# EAGLE design BATT MONITOR (EAGLE 9.6.2)

## Sheet 1 of 2

## Sheet 2 of 2
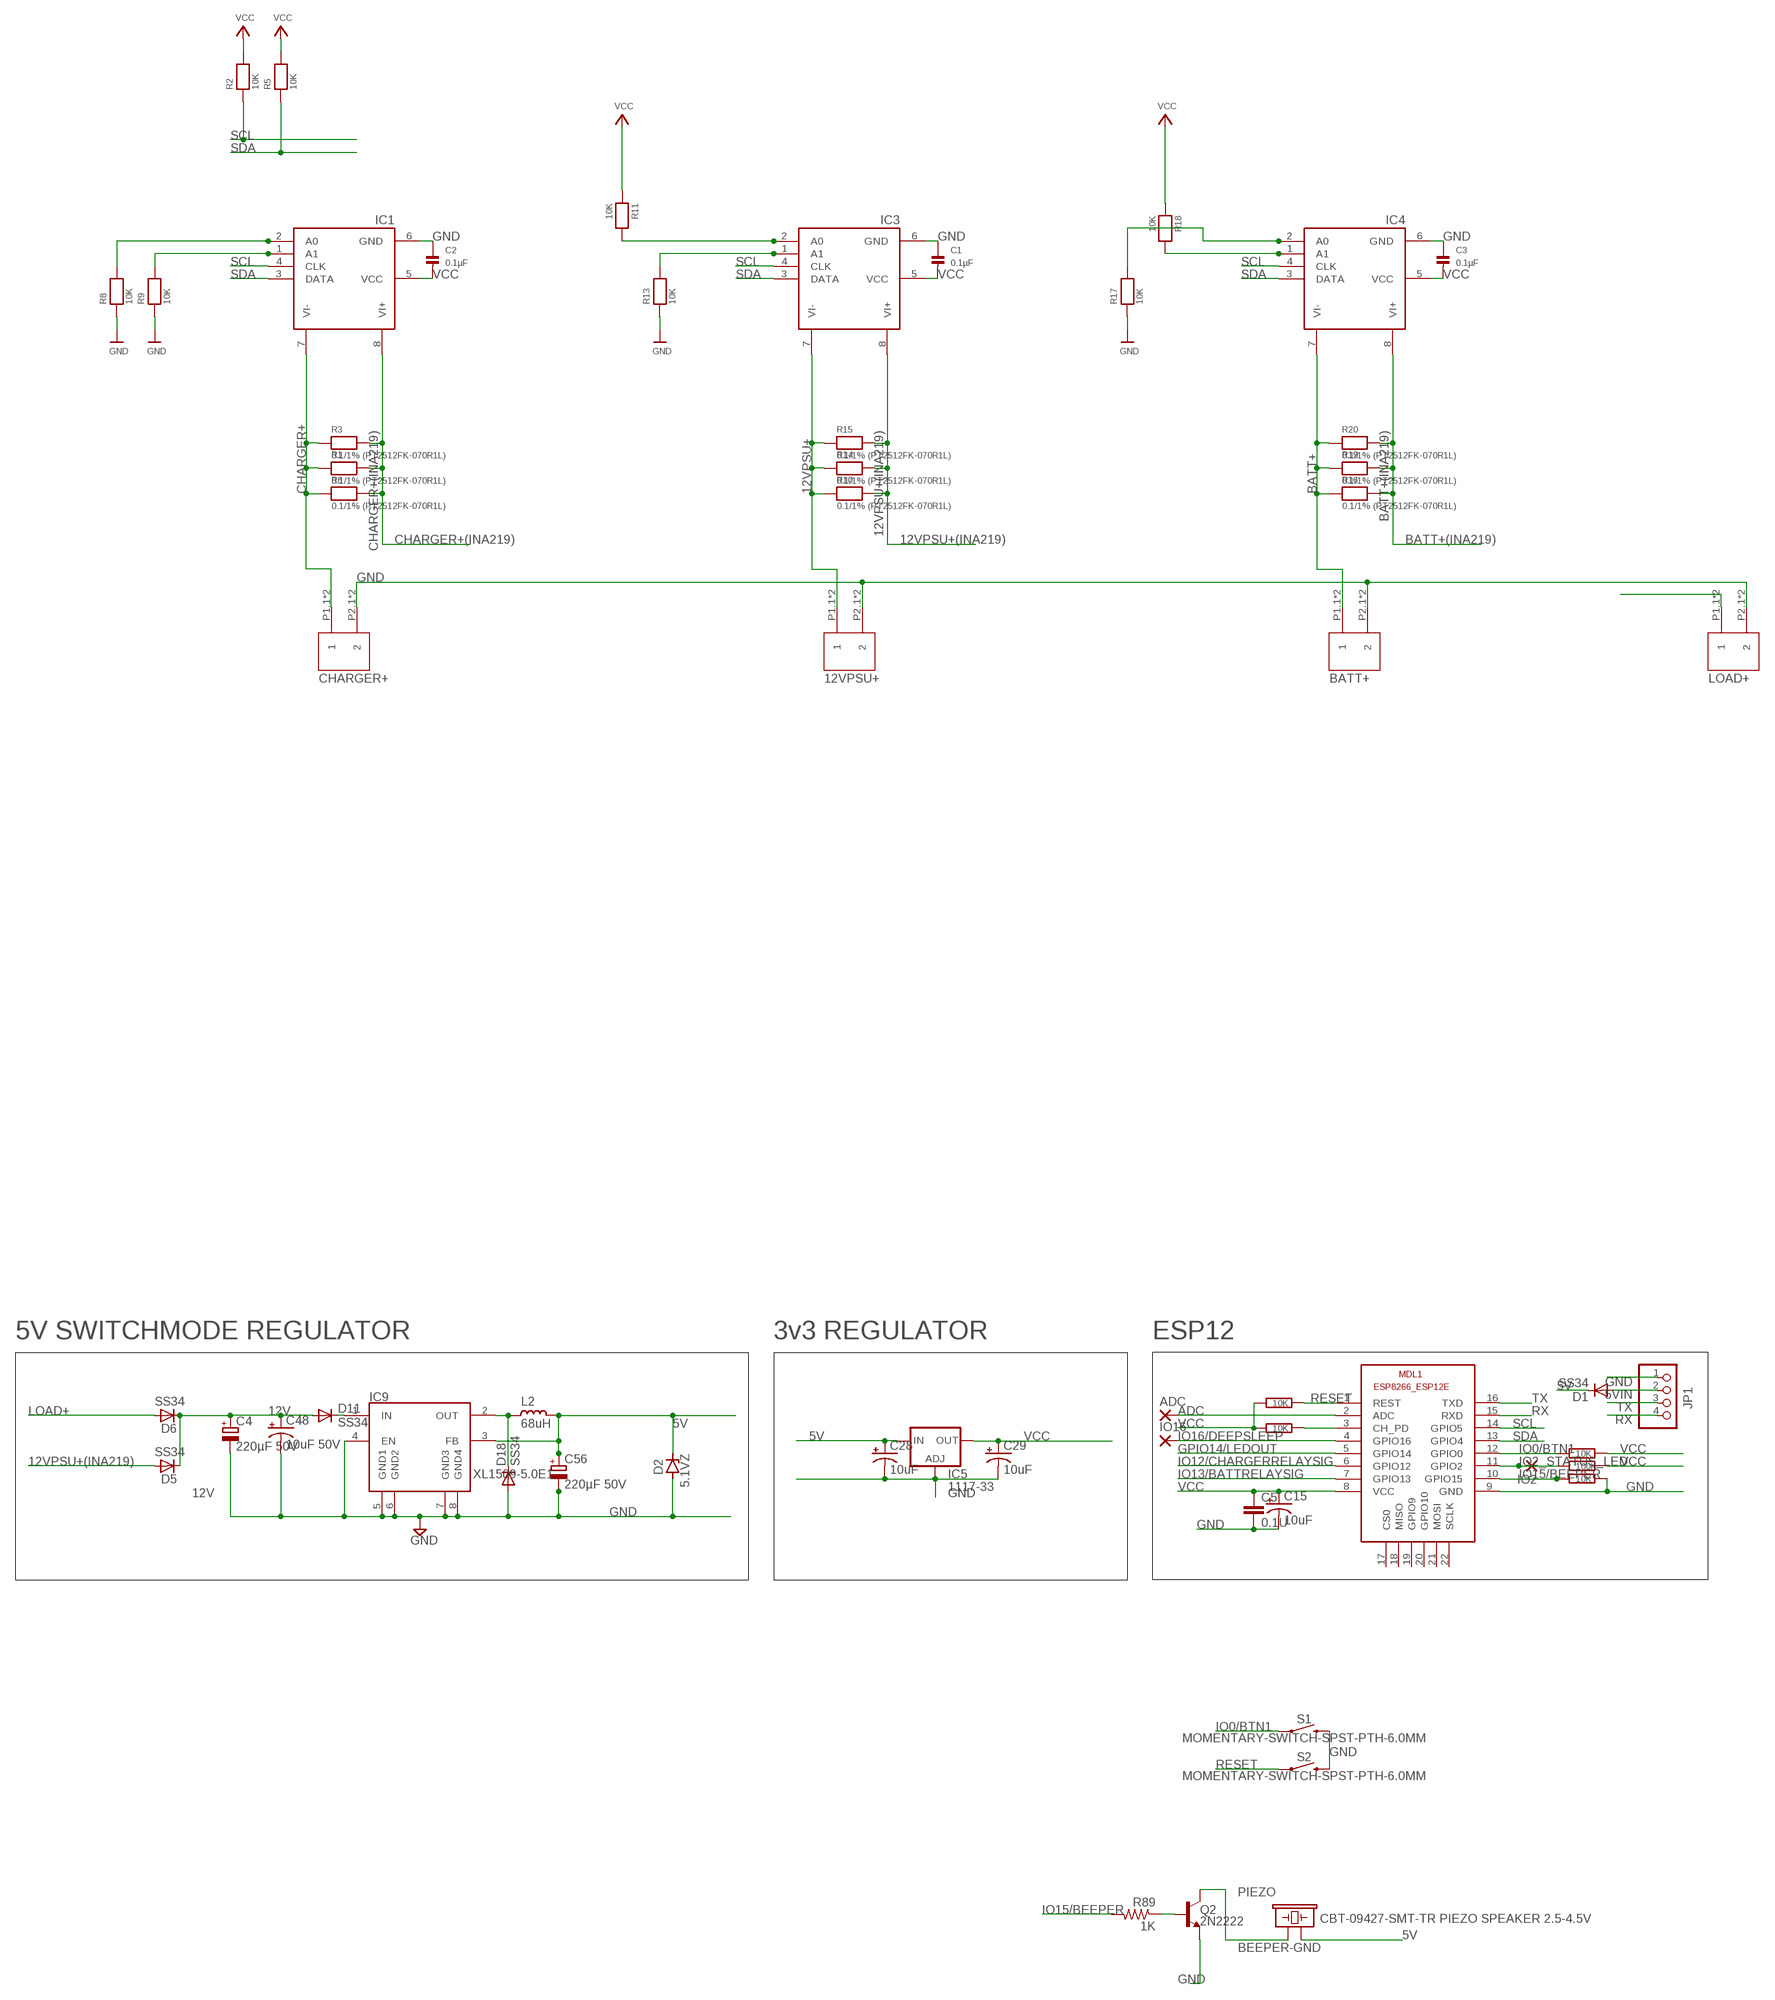
[diagram p0: schematic, sheet 2, part 1 of 2]
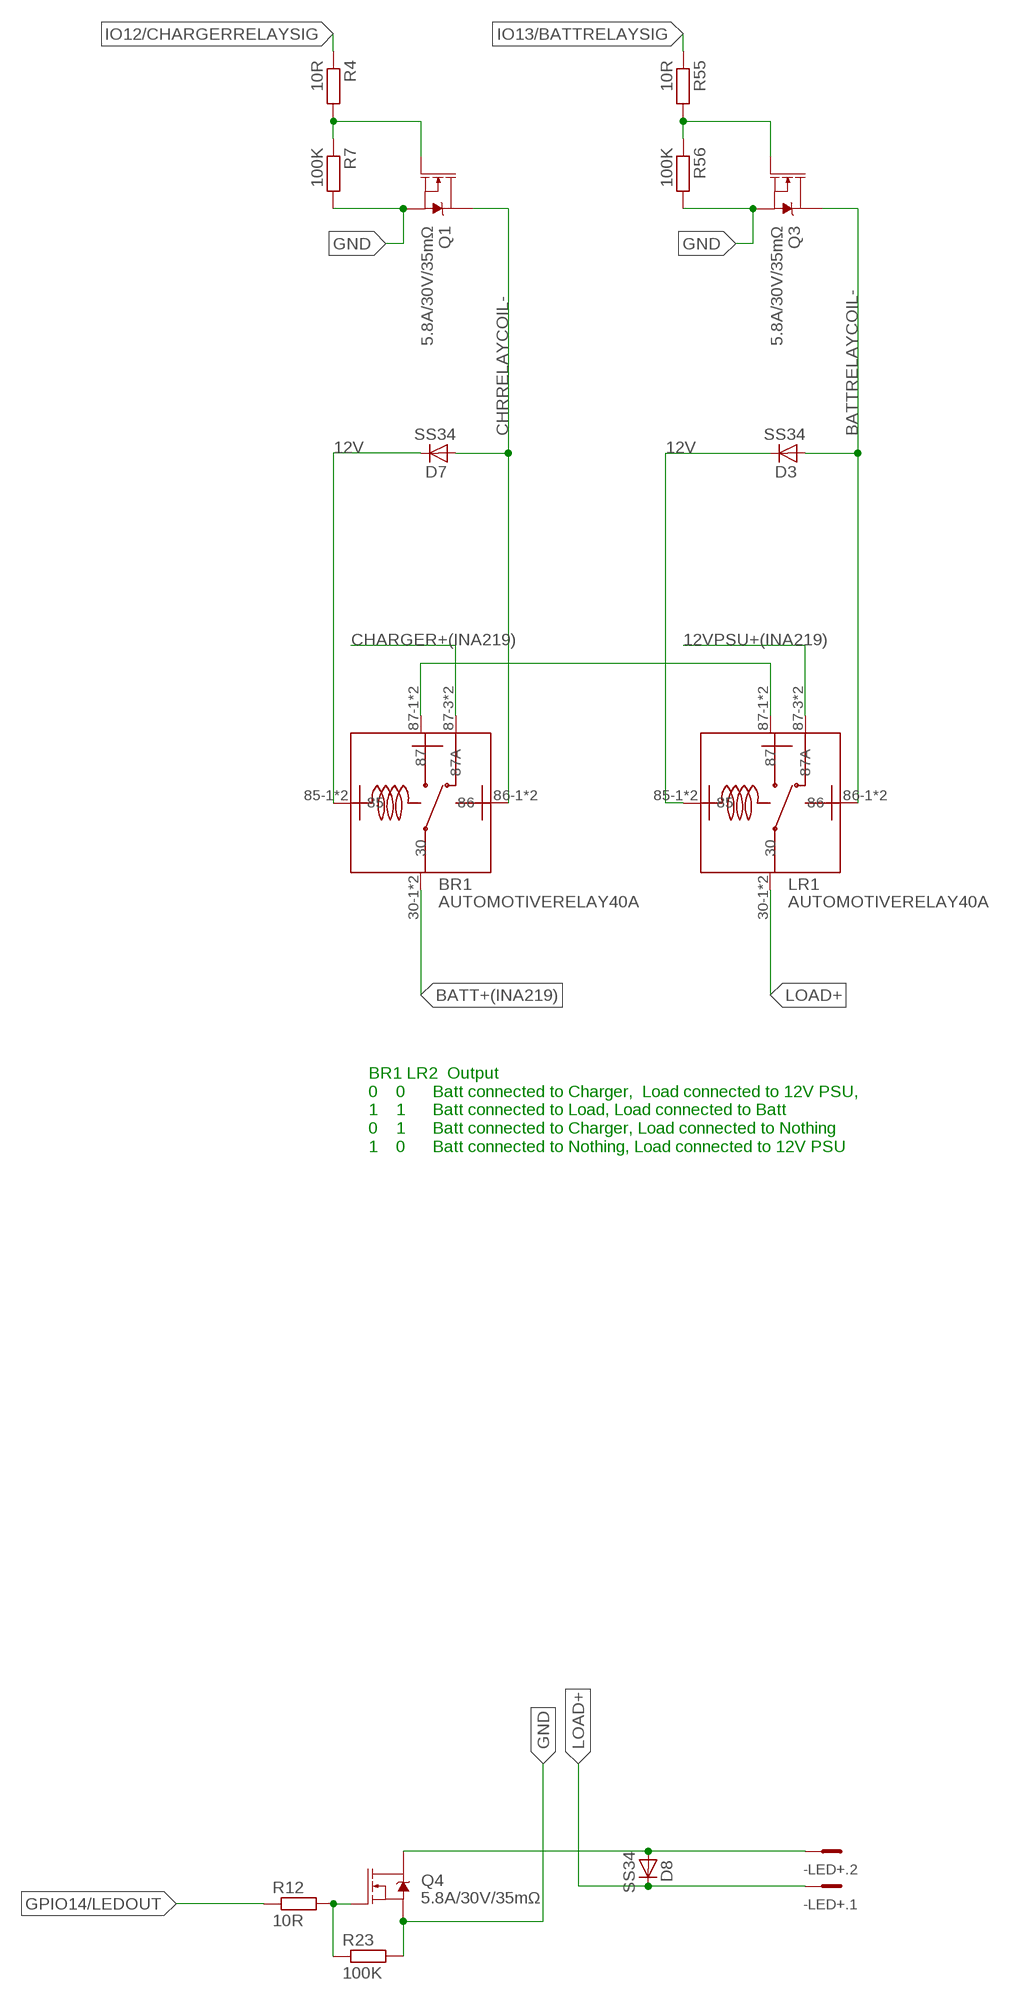
[diagram p1: schematic, sheet 2, part 2 of 2]

### Parts
-LED+  MCV2  [MCV2]
ADC  2,54/1,1  [2,54/1,1]
BR1  AUTOMOTIVERELAY40A  [AUTOMOTIVERELAY40A]
C1  0.1µF  CAP_CERAMIC1206  [1206]
C2  0.1µF  CAP_CERAMIC1206  [1206]
C3  0.1µF  CAP_CERAMIC1206  [1206]
C4  220µF 50V  CPOL-EUE3.5-10  [E3,5-10]
C5  0.1U  C-EUC1206  [C1206]
C15  10uF  CAP_POL1206  [EIA3216]
C28  10uF  CAP_POL1206  [EIA3216]
C29  10uF  CAP_POL1206  [EIA3216]
C48  10uF 50V  CAP_POL1206  [EIA3216]
C56  220µF 50V  CPOL-EUE3.5-10  [E3,5-10]
CHARGER1  BARRIERTERMINAL  [BARRIERTERMINAL]
CHARGER2  BARRIERTERMINAL  [BARRIERTERMINAL]
CHARGER3  BARRIERTERMINAL  [BARRIERTERMINAL]
CHARGER4  BARRIERTERMINAL  [BARRIERTERMINAL]
D1  SS34  DIODE-DO-214AC  [DO-214AC]
D2  5.1VZ  ZENER-DIODESMB  [SMB]
D3  SS34  D-SOD-87  [SOD87]
D5  SS34  D-SOD-87  [SOD87]
D6  SS34  D-SOD-87  [SOD87]
D7  SS34  D-SOD-87  [SOD87]
D8  SS34  D-SOD-87  [SOD87]
D11  SS34  DIODE-DO-214AC  [DO-214AC]
D18  SS34  DIODE-DO-214AC  [DO-214AC]
IC1  INA219D  [SO08]
IC3  INA219D  [SO08]
IC4  INA219D  [SO08]
IC5  1117-33  LD117AS33TR  [SOT223]
IC9  XL1509-5.0E1  XL1509  [SO08]
IO2  2,54/1,1  [2,54/1,1]
IO16  2,54/1,1  [2,54/1,1]
JP1  PINHD-1X4  [1X04]
L2  68uH  L_CD75  [CD75]
LR1  AUTOMOTIVERELAY40A  [AUTOMOTIVERELAY40A]
MDL1  ESP8266-12EESP8266-ESP12E  [ESP8266-ESP12E]
PIEZO  CBT-09427-SMT-TR PIEZO SPEAKER 2.5-4.5V  BUZZER-PTH  [BUZZER-12MM]
Q1  5.8A/30V/35mΩ  MOSFET-NCH-AO3404A  [SOT23-3]
Q2  2N2222  TRANS_NPN-MMBT2222AL  [SOT23-3]
Q3  5.8A/30V/35mΩ  MOSFET-NCH-AO3404A  [SOT23-3]
Q4  5.8A/30V/35mΩ  MOSFET-NCH-AO3404A  [SOT23-3]
R1  0.1/1% (PT2512FK-070R1L)  RESISTOR2512  [2512]
R2  10K  RESISTOR1206  [1206]
R3  0.1/1% (PT2512FK-070R1L)  RESISTOR2512  [2512]
R4  10R  R-EU_R1206  [R1206]
R5  10K  RESISTOR1206  [1206]
R6  0.1/1% (PT2512FK-070R1L)  RESISTOR2512  [2512]
R7  100K  R-EU_R1206  [R1206]
R8  10K  RESISTOR1206  [1206]
R9  10K  RESISTOR1206  [1206]
R10  0.1/1% (PT2512FK-070R1L)  RESISTOR2512  [2512]
R11  10K  RESISTOR1206  [1206]
R12  10R  R-EU_M1206  [M1206]
R13  10K  RESISTOR1206  [1206]
R14  0.1/1% (PT2512FK-070R1L)  RESISTOR2512  [2512]
R15  0.1/1% (PT2512FK-070R1L)  RESISTOR2512  [2512]
R16  0.1/1% (PT2512FK-070R1L)  RESISTOR2512  [2512]
R17  10K  RESISTOR1206  [1206]
R18  10K  RESISTOR1206  [1206]
R19  0.1/1% (PT2512FK-070R1L)  RESISTOR2512  [2512]
R20  0.1/1% (PT2512FK-070R1L)  RESISTOR2512  [2512]
R21  100K  R-EU_R1206  [R1206]
R22  10K  R-EU_R1206  [R1206]
R23  100K  R-EU_M1206  [M1206]
R28  10K  R-EU_R1206  [R1206]
R29  10K  R-EU_R1206  [R1206]
R31  10K  R-EU_R1206  [R1206]
R55  10R  R-EU_R1206  [R1206]
R56  100K  R-EU_R1206  [R1206]
R89  1K  R-US_R1206  [R1206]
S1  MOMENTARY-SWITCH-SPST-PTH-6.0MM  [TACTILE_SWITCH_PTH_6.0MM]
S2  MOMENTARY-SWITCH-SPST-PTH-6.0MM  [TACTILE_SWITCH_PTH_6.0MM]

### Nets
5V: C28.A(+) C56.+ D1.1(C) D2.C IC5.3(IN) IC9.3(FB) L2.1 PIEZO.+
5VIN: D1.2(A) JP1.2
12V: BR1.85-1 BR1.85-2 C4.+ C48.A(+) D3.1(C) D5.1(C) D6.1(C) D7.1(C) D11.2(A) LR1.85-1 LR1.85-2
12VPSU+: CHARGER4.P1.1 CHARGER4.P1.2 IC3.7(VI-) R10.1 R14.1 R15.1
12VPSU+(INA219): D5.2(A) IC3.8(VI+) LR1.87-3(87A) LR1.87-4(87A) R10.2 R14.2 R15.2
ADC: ADC.1(P) MDL1.2(ADC)
BATT+: CHARGER1.P1.1 CHARGER1.P1.2 IC4.7(VI-) R16.1 R19.1 R20.1
BATT+(INA219): BR1.30-1 BR1.30-2 IC4.8(VI+) R16.2 R19.2 R20.2
BATTRELAYCOIL-: D3.2(A) LR1.86-1 LR1.86-2 Q3.3(D)
BEEPER-GND: PIEZO.- Q2.3(C)
CHARGER+: CHARGER3.P1.1 CHARGER3.P1.2 IC1.7(VI-) R1.1 R3.1 R6.1
CHARGER+(INA219): BR1.87-3(87A) BR1.87-4(87A) IC1.8(VI+) R1.2 R3.2 R6.2
CHRRELAYCOIL-: BR1.86-1 BR1.86-2 D7.2(A) Q1.3(D)
GND: C1.1 C2.1 C3.1 C4.- C5.2 C15.C(-) C28.C(-) C29.C(-) C48.C(-) C56.- CHARGER1.P2.1 CHARGER1.P2.2 CHARGER2.P2.1 CHARGER2.P2.2 CHARGER3.P2.1 CHARGER3.P2.2 CHARGER4.P2.1 CHARGER4.P2.2 D2.A D18.2(A) IC1.6(GND) IC3.6(GND) IC4.6(GND) IC5.1(ADJ) IC9.4(EN) IC9.5(GND1) IC9.6(GND2) IC9.7(GND3) IC9.8(GND4) JP1.1 MDL1.9(GND) Q1.2(S) Q2.2(E) Q3.2(S) Q4.2(S) R7.2 R8.1 R9.1 R13.1 R17.1 R23.2 R31.2 R56.2 S1.3 S2.3
GPIO14/LEDOUT: MDL1.5(GPIO14) R12.1
IO0/BTN1: MDL1.12(GPIO0) R22.1 S1.1
IO2_STATUS_LED: IO2.1(P) MDL1.11(GPIO2) R21.1
IO12/CHARGERRELAYSIG: MDL1.6(GPIO12) R4.1
IO13/BATTRELAYSIG: MDL1.7(GPIO13) R55.1
IO15/BEEPER: MDL1.10(GPIO15) R31.1 R89.2
IO16/DEEPSLEEP: IO16.1(P) MDL1.4(GPIO16)
LOAD+: -LED+.1 CHARGER2.P1.1 CHARGER2.P1.2 D6.2(A) D8.1(C) LR1.30-1 LR1.30-2
N$1: D18.1(C) IC9.2(OUT) L2.2
N$2: Q4.1(G) R12.2 R23.1
N$4: IC1.1(A1) R9.2
N$7: IC1.2(A0) R8.2
N$8: Q1.1(G) R4.2 R7.1
N$9: BR1.87-1 BR1.87-2 LR1.87-1 LR1.87-2
N$11: Q2.1(B) R89.1
N$13: IC3.1(A1) R13.2
N$14: IC3.2(A0) R11.2
N$15: IC4.1(A1) R18.2
N$16: IC4.2(A0) R17.2
N$18: MDL1.3(CH_PD) R28.2
N$26: D11.1(C) IC9.1(IN)
N$37: Q3.1(G) R55.2 R56.1
N$41: -LED+.2 D8.2(A) Q4.3(D)
RESET: MDL1.1(REST) R29.2 S2.1
RX: JP1.4 MDL1.15(RXD)
SCL: IC1.4(CLK) IC3.4(CLK) IC4.4(CLK) MDL1.14(GPIO5) R2.1
SDA: IC1.3(DATA) IC3.3(DATA) IC4.3(DATA) MDL1.13(GPIO4) R5.1
TX: JP1.3 MDL1.16(TXD)
VCC: C1.2 C2.2 C3.2 C5.1 C15.A(+) C29.A(+) IC1.5(VCC) IC3.5(VCC) IC4.5(VCC) IC5.4(OUT) MDL1.8(VCC) R2.2 R5.2 R11.1 R18.1 R21.2 R22.2 R28.1 R29.1
Unconnected: MDL1.17(CS0) MDL1.18(MISO) MDL1.19(GPIO9) MDL1.20(GPIO10) MDL1.21(MOSI) MDL1.22(SCLK)

### Notes on the sheet
- BR1 LR2  Output
  0    0      Batt connected to Charger,  Load connected to 12V PSU,
  1    1      Batt connected to Load, Load connected to Batt
  0    1      Batt connected to Charger, Load connected to Nothing
  1    0      Batt connected to Nothing, Load connected to 12V PSU
- 5V SWITCHMODE REGULATOR | 3v3 REGULATOR | ESP12

## Library data of the parts
-LED+ = con-phoenix-381_l:MCV2: Mini-Combicon 3.81mm vertikal 2polig MCV 1,5/2-G-3,81 Artikel-Nr. 1803426
ADC IO2 IO16 = wirepad:2,54/1,1: THROUGH-HOLE PAD
BR1 LR1 = AUTOMOTIVERELAYS:AUTOMOTIVERELAY40A
C1-C3 = microbuilder:CAP_CERAMIC: Ceramic Capacitors 0402 - 0402 Surface Mount Capacitors 16pF 50V 5% [Digikey: 445-4899-2-ND] 18pF 50V 5% [Digikey: 490-1281-2-ND] 22pF 50V 5% [Digikey: 490-1283-2-ND] 68pF 50V 5% [Digikey: 490-1289-2-ND] 0.1uF 10V 10% [Digikey: 490-1318-2-ND] 1.0uF 6.3V 10% [Digikey: 490-1320-2-ND] 0603 - 0603 Surface Mount Capacitors 16 pF 50V 5% [Digikey: 445-5051-2-ND] 22 pF 50V [Digikey: PCC220ACVTR-ND] 33 pF 50V 5% [Digikey: 490-1415-1-ND] 56pF 50V 5% [Digikey: 490-1421-1-ND] 220pF 50V 5% [Digikey: 445-1285-1-ND] 680 pF 50V 2200 pF 50V 5% C0G [Digikey: 445-1297-1-ND] 5600 pF 100V 5% X7R [Digikey: 478-3711-1-ND] 0.1 µF 25V 10% [Digikey: PCC2277TR-ND] 0.22 µF 16V 10% X7R [Digikey: 445-1318-1-ND] 1.0 µF 25V 10% [Digikey: 445-5146-2-ND] 0603 - RF Specific 3pF 250V +/-0.1pF RF [Digikey: 712-1347-1-ND] 18 pF 250V 5% [Digikey: 478-3505-1-ND or 712-1322-1-ND] 56 pF 250V 5% C0G RF [Digikey: 490-4867-1-ND] 68 pF 250V RF [Digikey: 490-4868-1-ND] 0805 - 0805 Surface Mount Capacitors 220 pF 250V 2% RF Ceramic Capacitor [Digikey: 712-1398-1-ND] 1000 pF 50V 2% NP0 Ceramic Capacitor [Digikey: 478-3760-1-ND] 0.1 µF 25V 10% Ceramic Capacitor [Digikey: PCC1828TR-ND] 1.0 µF 16V 10% Ceramic Capacitor[Digikey: 490-1691-2-ND] 10.0 µF 10V 10% Ceramic Capacitor[Digikey: 709-1228-1-ND] 10.0 uF 16V 10% Ceramic Capacitor [Digikey: 478-5165-2-ND] 47 uF 6.3V 20% Ceramic Capacitor [Digikey: 587-1779-1-ND or 399-5506-1-ND] 1206 - 1206 Surface Mount Capacitors 47uF 10V 20% Ceramic Capacitor [Digikey: 490-5528-1-ND or 399-5508-1-ND or 445-6010-1-ND] 100uF 6.3V -20%, +80% Y5V Ceramic Capacitor (Digikey: 490-4512-1-ND, Mouser: 81-GRM31CF50J107ZE1L)
C4 C56 = rcl:CPOL-EU: POLARIZED CAPACITOR, European symbol; SPICEPREFIX: C
C5 = rcl:C-EU: CAPACITOR, European symbol
C15 C28 C29 C48 = SparkFun:CAP_POL: Capacitor Polarized These are standard SMD and PTH capacitors. Normally 10uF, 47uF, and 100uF in electrolytic and tantalum varieties. Always verify the external diameter of the through hole cap, it varies with capacity, voltage, and manufacturer. The EIA devices should be standard.
CHARGER1-CHARGER4 = Barrier Terminals 2 pin:BARRIERTERMINAL
D1 D11 D18 = dp_devices:DIODE: Various Diode Packages
D2 = diode:ZENER-DIODE: Z-Diode
D3 D5-D8 = semicon-smd-ipc:D-: DIODE unfilled
IC1 IC3 IC4 = AWJLEagleLib:INA219: Texas Instruments INA219 power monitor
IC5 = v-reg:LD117A?*: Low drop fixed and adjustable positive voltage regulators 1 A Source: http://www.st.com/stonline/products/literature/ds/7194/ld1117axx.pdf
IC9 = Cohesion_parts:XL1509
JP1 = pinhead:PINHD-1X4: PIN HEADER
L2 = rc-master-smd:L_: INDUCTOR
MDL1 = ESP8266-ESP12E:ESP8266-12E: ESP8266-12E with additional I/O and GPIO04/05 corrected The author cannot warrant that this library is free from error or will meet your specific requirements. Created by PuceBaboon.com. Komagane, Nagano, JAPAN
PIEZO = SparkFun-Electromechanical:BUZZER: Buzzer Small round buzzers that operate around the audible 2kHz range. You can use these as speakers to create simple music or user interfaces. Variant Overview: PTH - Mini Speaker - PC Mount 12mm 2.048kHz <https://www.sparkfun.com/products/7950> PTH_KIT - Mini Speaker - PC Mount 12mm 2.048kHz <https://www.sparkfun.com/products/7950> KIT simplifies soldering by adding stop mask to one side of the pads. PTH_NO_SILK - Mini Speaker - PC Mount 12mm 2.048kHz <https://www.sparkfun.com/products/7950> No silkscreen indicator of buzzer outline. PTH_KIT_NO_SILK - Mini Speaker - PC Mount 12mm 2.048kHz <https://www.sparkfun.com/products/7950> KIT package w/o silkscreen SMD - Buzzer Audio Magnetic (CCV-084B16) SMD buzzer used on, e.g. the LilyPad Buzzer <https://www.sparkfun.com/products/8463> and RFID USB Reader <https://www.sparkfun.com/products/9963>. SMD_KIT - Buzzer Audio Magnetic (CCV-084B16) SMD Buzzer with elongated pins to make soldering easier. Used on the SparkFun Simon Says - Surface Mount Soldering Kit <https://www.sparkfun.com/products/10935>.; PROD_ID: COMP-08253; SF_SKU: COM-07950
Q1 Q3 Q4 = SparkFun-DiscreteSemi:MOSFET-NCH: N-channel MOSFETs Voltage controlled devices that allow control of high current outputs. SparkFun Products: SparkFun OpenScale <https://www.sparkfun.com/products/13261> SparkFun Digital Sandbox <https://www.sparkfun.com/products/12651> SparkFun Monster Moto Shield <https://www.sparkfun.com/products/10182> SparkFun MOSFET Power Controller <https://www.sparkfun.com/products/11214>; PROD_ID: TRANS-12988
Q2 = SparkFun-DiscreteSemi:TRANS_NPN: NPN transistor Current controlled devices typically used to amplify current or used as a switch. BC547 - COM-08928 <http://www.sparkfun.com/products/8928> (TO-92 45V 100mA) (1.Collector 2.Base 3.Emitter) 2N3904 - COM-00521 <http://www.sparkfun.com/products/521> (TO-92 40V 200mA) (1.Emitter 2.Base 3.Collector) P2N2222A - COM-12852 <http://www.sparkfun.com/products/12852> (TO-92 40V 600mA) (1.Collector 2.Base 3.Emitter); PROD_ID: TRANS-08049; VALUE: 600mA/40V
R1-R3 R5 R6 R8-R11 R13-R20 = microbuilder:RESISTOR: Resistors 0402 - 0402 Surface Mount Package 22 Ohm 1% 1/16W [Digikey: 311-22.0LRTR-ND] 33 Ohm 5% 1/16W 1.0K 5% 1/16W 1.5K 5% 1/16W 2.0K 1% 1/16W 10.0K 1% 1/16W [Digikey: 311-10.0KLRTR-ND] 10.0K 5% 1/16W [Digikey: RMCF0402JT10K0TR-ND] 12.1K 1% 1/16W [Digikey: 311-22.0LRTR-ND] 100.0K 5% 1/16W 0603 - 0603 Surface Mount Package 0 Ohm 1/10 Watt 1% Resistor 15 Ohm 1/10 Watt 1% Resistor 33 Ohm 1/10 Watt 1% Resistor 49.9 Ohm 1/10 Watt 1% Resistor 100 Ohm 1/10 Watt 1% Resistor 150 Ohm 1/10 Watt 1% Resistor 240 Ohm 1/10 Watt 1% Resistor 390 Ohm 1/10 Watt 1% Resistor 560 Ohm 1/10 Watt 1% Resistor 680 Ohm 1/10 Watt 1% Resistor 750 Ohm 1/10 Watt 1% Resistor 1.0K Ohm 1/10 Watt 1% Resistor 1.5K Ohm 1/10 Watt 1% Resistor 2.0K Ohm 1/10 Watt 1% Resistor 2.2K Ohm 1/10 Watt 1% Resistor 3.3K Ohm 1/10 Watt 1% Resistor 4.7K Ohm 1/10 Watt 1% Resistor 10.0K Ohm 1/10 Watt 1% Resistor 12.0K Ohm 1/10 Watt 1% Resistor 12.1K Ohm 1/10 Watt 1% Resistor 20.0K Ohm 1/10 Watt 1% Resistor 33.0K Ohm 1/10 Watt 1% Resistor 100.0K Ohm 1/10 Watt 1% Resistor 0805 - 0805 Surface Mount Package 0 Ohm 1/8 Watt 1% Resistor 33 Ohm 1/8 Watt 1% Resistor 100 Ohm 1/8 Watt 1% Resistor 150 Ohm 1/8 Watt 1% Resistor 200 Ohm 1/8 Watt 1% Resistor 240 Ohm 1/8 Watt 1% Resistor 330 Ohm 1/8 Watt 1% Resistor 390 Ohm 1/8 Watt 1% Resistor 470 Ohm 1/8 Watt 1% Resistor 1.0K Ohm 1/8 Watt 1% Resistor 1.5K Ohm 1/8 Watt 1% Resistor 2.0K Ohm 1/8 Watt 1% Resistor 4.7K Ohm 1/8 Watt 1% Resistor 5.1K Ohm 1/8 Watt 1% Resistor 5.6K Ohm 1/8 Watt 1% Resistor 10.0K Ohm 1/8 Watt 1% Resistor 22.0K Ohm 1/8 Watt 1% Resistor 33.0K Ohm 1/8 Watt 1% Resistor 100K Ohm 1/8 Watt 1% Resistor 1206 - 1206 Surface Mount Package 2012 - 2010 Surface Mount Package 0.11 Ohm 1/2 Watt 1% Resistor - Digikey: RHM.11UCT-ND
R4 R7 R12 R23 R55 R56 = rcl:R-EU_: RESISTOR, European symbol; SPICEPREFIX: R
R21 R22 R28 R29 R31 = rcl:R-EU_: RESISTOR, European symbol
R89 = adafruit:R-US_: RESISTOR, American symbol
S1 S2 = SparkFun-Switches:MOMENTARY-SWITCH-SPST: Momentary Switch (Pushbutton) - SPST Normally-open (NO) SPST momentary switches (buttons, pushbuttons). Variants PTH-12MM - 12mm square, through-hole Momentary Pushbutton Switch - 12mm Square <https://www.sparkfun.com/products/9190> (COM-09190) PTH-6.0MM, PTH-6.0MM-KIT - 6.0mm square, through-hole Mini Pushbutton Switch <https://www.sparkfun.com/products/97> (COM-00097) KIT package intended for soldering kit's - only one side of pads' copper is exposed. PTH-RIGHT-ANGLE-KIT - Right-angle, through-hole Right Angle Tactile Button <https://www.sparkfun.com/products/10791> - Used on SparkFun BigTime Watch Kit <https://www.sparkfun.com/products/11734> SMD-12MM - 12mm square, surface-mount Tactile Button - SMD (12mm) <https://www.sparkfun.com/products/12993> (COM-12993) Used on SparkFun PicoBoard <https://www.sparkfun.com/products/11888> SMD-4.5MM - 4.5mm Square Trackball Switch Used on SparkFun Blackberry Trackballer Breakout <https://www.sparkfun.com/products/13169> SMD-4.6MMX2.8MM - 4.60mm x 2.80mm, surface mount Used on SparkFun SAMD21 Mini Breakout <https://www.sparkfun.com/products/13664> SMD-5.2MM, SMD-5.2-REDUNDANT - 5.2mm square, surface-mount Mini Pushbutton Switch - SMD <https://www.sparkfun.com/products/8720> (COM-08720) Used on Arduino Pro Mini <https://www.sparkfun.com/products/11114> REDUNDANT package connects both switch circuits together SMD-6.0X3.5MM - 6.0 x 3.5mm, surface mount Momentary Reset Switch SMD <https://www.sparkfun.com/products/8229> (COM-08229) SMD-6.2MM-TALL - 6.2mm square, surface mount Tactile Button - SMD (6mm) <https://www.sparkfun.com/products/12992> Used on SparkFun Digital Sandbox <https://www.sparkfun.com/products/12651> SMD-RIGHT-ANGLE - Right-angle, surface mount Used on SparkFun Block for Intel® Edison - Arduino <https://www.sparkfun.com/products/13036>; PROD_ID: SWCH-08441; SF_SKU: COM-00097

## Net classes
0 default: width 0.203 mm, clearance 0.152 mm
1 power: width 0.6 mm, clearance 0.305 mm

## Board
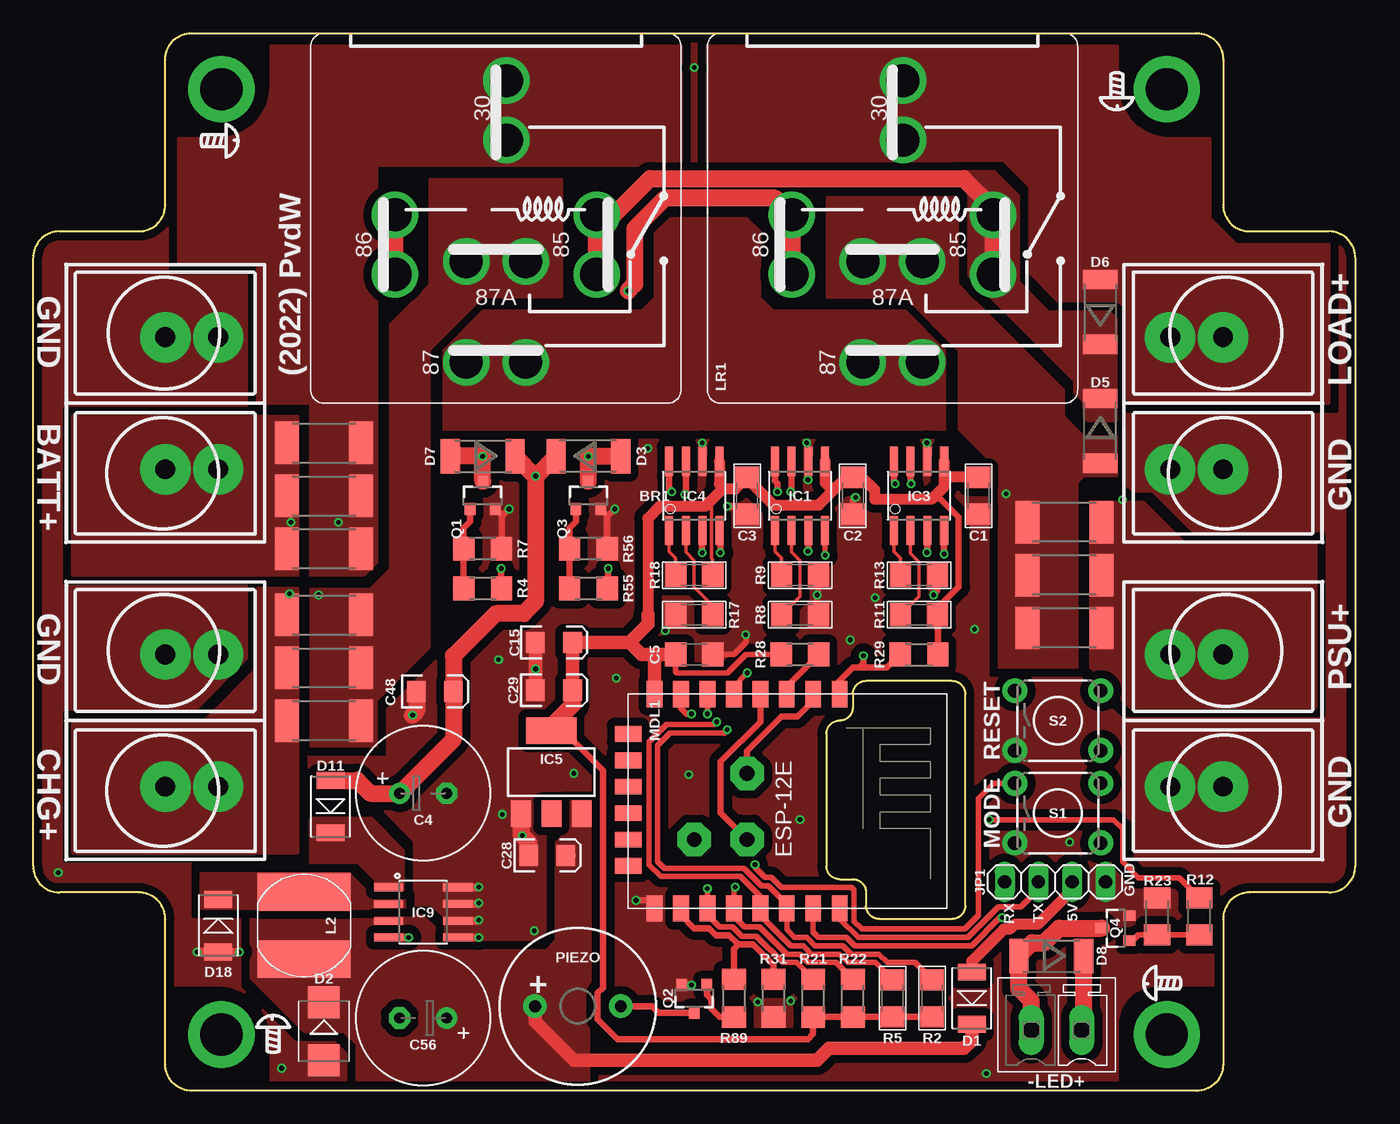
[diagram p2: board, top side]
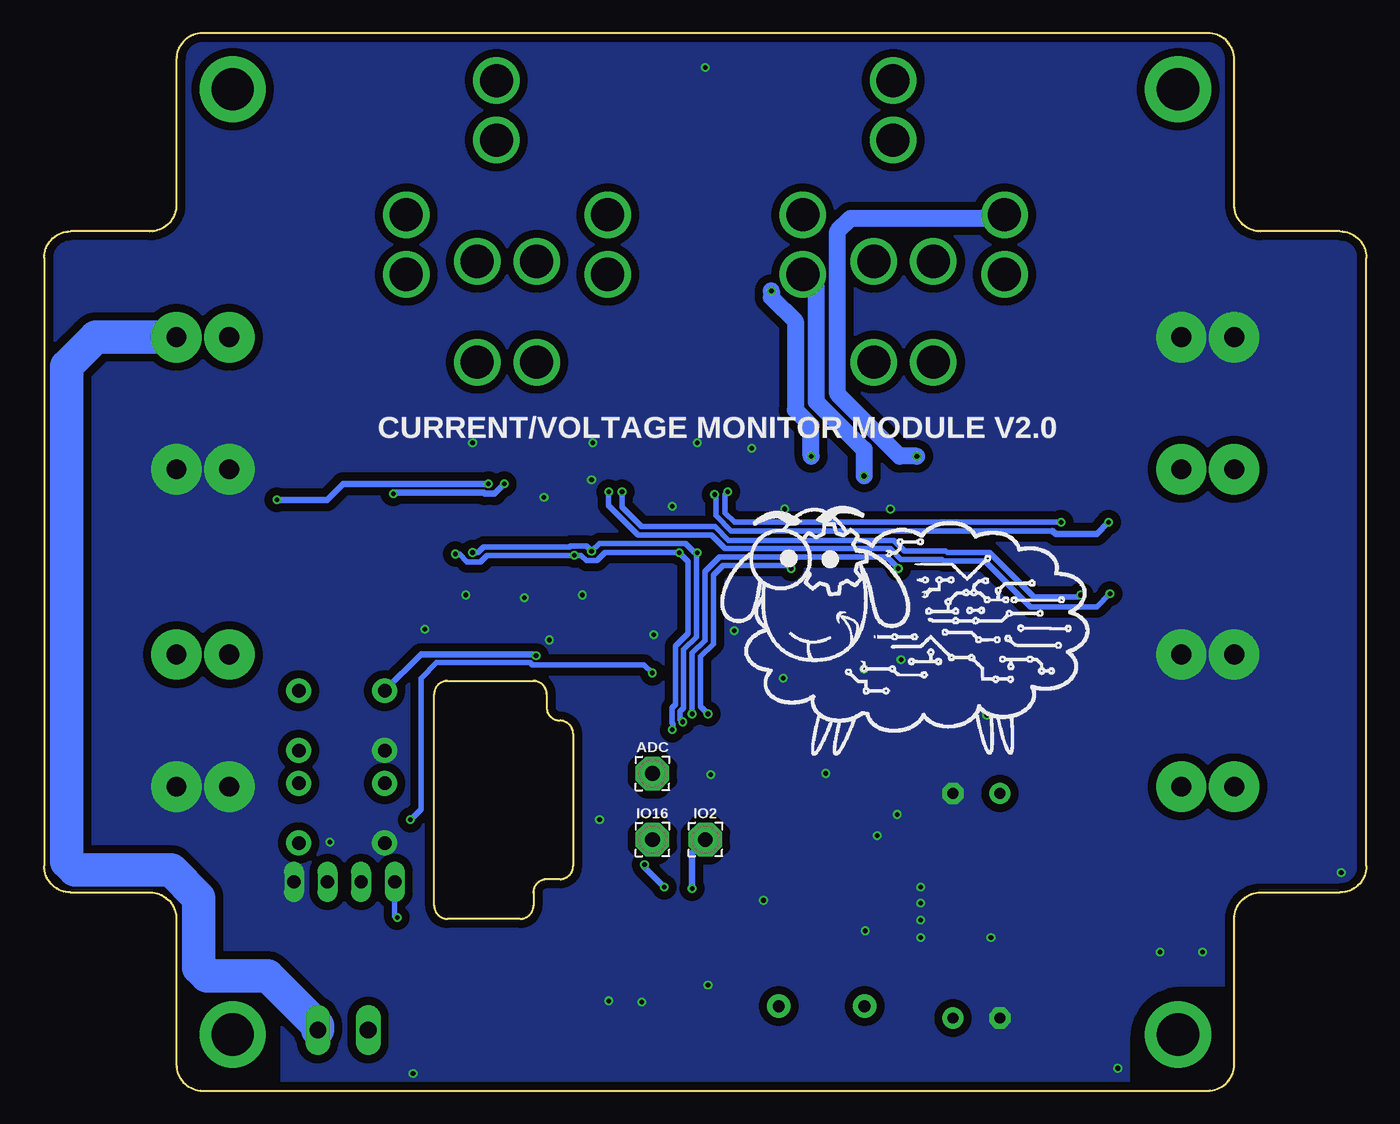
[diagram p3: board, bottom side, seen from below]

Size 100 x 80 mm. Coordinates in mm from the lower left corner, seen from the top.
Outline: 10,2 10,13 arc90 8,15 2,15 arc-90 0,17 0,63 arc-90 2,65 8,65 arc90 10,67 10,78 arc-90 12,80 88,80 arc-90 90,78 90,67 arc90 92,65 98,65 arc-90 100,63 100,17 arc-90 98,15 92,15 arc90 90,13 90,2 arc-90 88,0 12,0 arc-90 10,2
Outline: 62,30 62,29 arc-90 61,28 arc90 60,27 60,17 arc90 61,16 62,16 arc-90 63,15 63,14 arc90 64,13 69.5,13 arc90 70.5,14 70.5,30 arc90 69.5,31 63,31 arc90 62,30
Copper layers (1*16): Top 0.035mm / dielectric 1.5mm / Bottom 0.035mm
Design rules "dirt_cheap_dirty_boards.v1": minimum track width 5mil, minimum drill 12mil, track to track 5mil, track to pad 5mil, pad to pad 5mil, via to via 5mil, smd to smd 0mil, copper to edge 10mil, drill to drill 10mil, minimum pad ring 10mil, minimum via ring 6mil, stop-mask expansion 2mil, vias tented up to drill 25mil, thermal gap 10mil

### Footprints (pad centres in the part's own frame; a part is rotated, then mirrored left to right if it is on the bottom)
MCV2 = drill 1.27 pad 1.905 long: 1 -1.905,0; 2 1.905,0
2,54/1,1 = drill 1.118 pad 2.54 octagon: 1 0,0
AUTOMOTIVERELAY40A = drill 2.5: 30-1 -0.8,-7.91; 30-2 -0.8,-12.41; 85-1 -7.62,2.25; 85-2 -7.62,-2.25; 86-1 7.62,2.25; 86-2 7.62,-2.25; 87-1 -2.25,8.89; 87-2 2.25,8.89; 87-3 -2.25,1.27; 87-4 2.25,1.27
1206 = smd 1.6 x 1.8: 1 -1.4,0; 2 1.4,0
E3,5-10 = drill 0.813 pad 1.6: + -1.778,0 | drill 0.813 pad 1.6 octagon: - 1.778,0
C1206 = smd 1.6 x 1.8: 1 -1.4,0; 2 1.4,0
EIA3216 = smd 1.4 x 1.6: A 1.4,0; C -1.4,0
BARRIERTERMINAL = drill 1.5 pad 3.81: P1.1 -5,0; P1.2 -5,-4; P2.1 5,0; P2.2 5,-4
DO-214AC = smd 1.27 x 2.1: 1 -1.98,0; 2 1.98,0
SMB = smd 2.4 x 2.4: A 2.2,0; C -2.2,0
SOD87 = smd 1.45 x 2.6: 1 -2.445,0; 2 2.445,0
SO08 = smd 0.61 x 2.21: 1 -1.905,-2.616; 2 -0.635,-2.616; 3 0.635,-2.616; 4 1.905,-2.616; 5 1.905,2.616; 6 0.635,2.616; 7 -0.635,2.616; 8 -1.905,2.616
SOT223 = smd 1.5 x 2: 1 -2.3,-3.15; 2 0,-3.15; 3 2.3,-3.15 | smd 3.8 x 2: 4 0,3.15
1X04 = drill 1.016 long: 1 -3.81,0; 2 -1.27,0; 3 1.27,0; 4 3.81,0
CD75 = smd 7 x 2.85: 1 0,2.54; 2 0,-2.54
ESP8266-ESP12E = smd 2 x 1.2: 1 0,16; 2 0,14; 3 0,12; 4 0,10; 5 0,8; 6 0,6; 7 0,4; 8 0,2; 9 16.2,2; 10 16.2,4; 11 16.2,6; 12 16.2,8; 13 16.2,10; 14 16.2,12; 15 16.2,14; 16 16.2,16 | smd 1.2 x 2: 17 11,0; 18 3,0; 19 5,0; 20 13,0; 21 7,0; 22 9,0
BUZZER-12MM = drill 0.9 pad 1.778: + 3.25,0; - -3.25,0
SOT23-3 = smd 0.8 x 0.9: 1 -0.95,-1; 2 0.95,-1; 3 0,1.1
2512 = smd 1.8 x 3.2: 1 -2.8,0; 2 2.8,0
R1206 = smd 1.6 x 1.803: 1 -1.422,0; 2 1.422,0
M1206 = smd 1.6 x 2: 1 -1.4,0; 2 1.4,0
TACTILE_SWITCH_PTH_6.0MM = drill 1.016 pad 1.88: 1 -3.251,2.261; 2 3.251,2.261; 3 -3.251,-2.261; 4 3.251,-2.261

### Placement (x,y rotation side)
-LED+  77.4,4.6 180 top
ADC  54,24 0 bottom
BR1  35,64 180 top
C1  71.5,45 90 top
C2  62,45 90 top
C3  54,45 90 top
C4  29.5,22.5 0 top
C5  50,33 0 top
C15  39.4,33.9 0 top
C28  38.9,17.8 0 top
C29  39.4,30.3 0 top
C48  30.4,30.2 0 top
C56  29.5,5.5 180 top
CHARGER1  10,52 90 top
CHARGER2  90,52 270 top
CHARGER3  10,28 90 top
CHARGER4  90,28 270 top
D1  71,7 90 top
D2  22,4.5 270 top
D3  42,48 0 top
D5  80.7,49.9 270 top
D6  80.7,58.9 90 top
D7  34,48 180 top
D8  77,10.2 180 top
D11  22.5,21.5 90 top
D18  14,12.5 270 top
IC1  58,45 0 top
IC3  67,45 0 top
IC4  50,45 0 top
IC5  39.2,24.1 0 top
IC9  29.5,13.5 270 top
IO2  50,19 0 bottom
IO16  54,19 0 bottom
JP1  77.3,15.8 180 top
L2  20.5,12.5 180 top
LR1  65,64 180 top
MDL1  45,30 270 top
PIEZO  41.2,6.4 180 top
Q1  34,45 0 top
Q2  50,7 180 top
Q3  42,45 0 top
Q4  81.9,12.3 90 top
R1  22,32 0 top
R2  68,7 270 top
R3  22,36 0 top
R4  34,38 180 top
R5  65,7 270 top
R6  22,28 0 top
R7  34,41 0 top
R8  58,36 180 top
R9  58,39 180 top
R10  78,43 180 top
R11  67,36 180 top
R12  88.2,13.2 270 top
R13  67,39 180 top
R14  78,35 180 top
R15  78,39 180 top
R16  22,41 0 top
R17  50,36 0 top
R18  50,39 180 top
R19  22,45 0 top
R20  22,49 0 top
R21  59,7 270 top
R22  62,7 270 top
R23  85,13.2 90 top
R28  58,33 0 top
R29  67,33 180 top
R31  56,7 270 top
R55  42,38 180 top
R56  42,41 0 top
R89  53,7 90 top
S1  77.5,21 0 top
S2  77.5,28 0 top

### Tracks (layer width: path | path; a pad name or v marks a point on that pad's centre or on a via)
5V
  Top 1.016: D1.1 71,3.8 70.4,3.2 60.2,3.2 59.3,2.3 40.9,2.3 37.95,5.25 PIEZO.+
  Top 1.27: C28.A 40.4,17.8
  pour Top (isolate 0.61, rank 2, no thermals): 29.5,13.2 16.5,13.2 16.5,8.5 20.5,4.5 23.5,4.5 24.5,3.5 24.5,0.5 42,0.5 42,7.6 42.5,8.1 42.5,21.9 40.7,21.9 40.7,19.9 39.6,18.8 39.6,11.4 38.8,10.6 30.7,10.6 30.5,10.8 30.5,12.2
5VIN
  Top 0.813: JP1.2 78.57,15.17 76,12.6 74.25,12.6 73.87,12.21 73.41,12.21 71,9.8 D1.2
12V  (via drill 0.35)
  Top 1.27: LR1.85-1 LR1.85-2 72.62,66.75 70.37,69 46.67,69 42.62,64.95 BR1.85-1 BR1.85-2 | D7.1 37.97,46.47 v38,46.5 | v38,46.5 38.03,46.47 D3.1 | v38,46.5 38,37 37.1,36.1 35,36.1 31.8,32.9 C48.A 31.8,26.58 C4.+ 25.5,22.5 24.52,23.48 D11.2
  Bottom 1.27: BR1.85-1 41.62,60.75 41.62,52.12 38,48.5 v38,46.5
  pour Top (isolate 0.61, rank 2, no thermals): 70.4,61.2 79.5,52.1 79.5,50.7 81.9,50.7 81.9,58.4 81.4,58.9 76.8,58.9 74.5,61.2 74.5,67.7 72.7,69.5 70.4,69.5
12VPSU+  (via drill 0.35)
  Top 0.508: IC3.7 66.36,45.94 v66.4,45.9
  Bottom 0.508: v66.4,45.9 77.4,45.9 78.6,44.7 v82.4,44.7
  pour Top (isolate 0.61, no thermals): 97,41.5 87,41.5 84,44.5 80,44.5 80,32 83,29 97,29
12VPSU+(INA219)  (via drill 0.35)
  Top 0.254: 75.2,34.8 R14.2
  Top 0.508: IC3.8 65.09,46.01 v65.2,45.9
  Bottom 0.508: v65.2,45.9 65.93,45.17 66.7,45.17 66.78,45.24 73.53,45.24 v73.6,45.17
  pour Top (isolate 0.61, no thermals): 60,68 60,60 66,60 70,56 70,50 73,47 73,32 79,32 79,46 79.5,46.5 82,46.5 82,49.5 79.5,49.5 78,51 78,53 70,61 70,68
ADC
  Top 0.508: ADC.1 54,25.7 56.6,28.3 57.8,28.3 59,29.5 MDL1.2
BATT+  (via drill 0.35)
  Top 0.508: R16.1 18.5,41.7 | v49.3,45.1 49.37,45.16 IC4.7
  Bottom 0.406: v49.3,45.1 49.2,45 49.2,43.5 48.04,42.34 23.74,42.34
  Bottom 0.508: v19.5,43 20.4,42.1 23.5,42.1 23.74,42.34
  pour Top (isolate 0.61, no thermals): 20,39 3,39 3,51 20,51
BATT+(INA219)  (via drill 0.35)
  Top 0.508: R16.2 24.8,41.1 | v48.3,45.3 48.09,45.51 IC4.8
  Bottom 0.406: v23.1,43 47.8,43 48.5,43.7 48.5,45.1 v48.3,45.3
  pour Top (isolate 0.61, rank 3, no thermals): 26,39 26,70 49,70 49,79 18,79 18,76 arc-90 14,72 11,72 11,62.5 17,62.5 17,52 21,52 21,39
BATTRELAYCOIL-  (via drill 0.35)
  Top 1.27: LR1.86-1 LR1.86-2 56.13,67.5 47.8,67.5 45.5,65.2 45.5,61 v45,60.5 | D3.2 v42,48 Q3.3
  Bottom 1.27: v42,48 42,50.3 43.2,51.5 43.2,58.2 45,60 v45,60.5
BEEPER-GND
  Top 0.508: PIEZO.- 46.8,6.4 47.3,5.9 Q2.3
CHARGER+  (via drill 0.35)
  Top 0.508: R3.1 19.2,37.4 v19.4,37.6 | v57.31,45.3 57.37,45.36 IC1.7
  Bottom 0.406: v57.31,45.3 57.31,44.28 55.07,42.04 49.54,42.04 48.5,41 36,41 35.2,40.2 32.1,40.2 31.96,40.06 28.87,40.06 25.4,36.6 20.4,36.6 v19.4,37.6
  pour Top (isolate 0.61, no thermals): 3,28 13,28 17,32 17,38 20,38 20,18 3,18
CHARGER+(INA219)  (via drill 0.35)
  Top 0.508: v56.3,45.3 56.3,45.91 56.09,46.12 IC1.8
  Bottom 0.406: v56.3,45.3 56.3,44.17 54.81,42.68 49.28,42.68 48.23,41.63 35.74,41.63 34.95,40.84 31.84,40.84 31.7,40.7 28.5,40.7 25.14,37.34 21.77,37.34 v21.6,37.5
  pour Top (isolate 0.61, no thermals): 21,26 21,38 25.5,38 27,39.5 27,58 30,61 30,69 40,69 40,60 34,60 30,56 30,33.5 26,29.5 26,26
CHRRELAYCOIL-  (via drill 0.35)
  Top 1.27: BR1.86-1 BR1.86-2 | D7.2 v34,48 Q1.3
  Bottom 1.27: v34,48 35.3,48 40,52.7 40,65 39,66 27.63,66 BR1.86-2
GND  (via drill 0.35)
  Top 0.406: R8.1 59.3,36.1 v59.3,37.5 59.4,37.6 R9.1 | R13.1 68.4,37.8 v68.1,37.5 | C5.2 53,33 53.9,33.9 v53.9,34.5
  Top 0.508: C3.1 53.4,44.2 v52.5,44.2 | IC1.6 58.63,46.23 v58.6,46.2 | C2.1 62,44.7 v62.2,44.9 | R56.2 43.42,43.42 | 43.42,43.42 v44,44 | R7.2 35.42,43.42 35.5,43.5 | 35.5,43.5 v36,44 | Q1.2 35,44 35.5,43.5 | Q3.2 43.42,43.53 43.42,43.42 | Q2.2 v49.8,8 | MDL1.9 46.4,14.4 v45.6,14.4
  Top 0.61: IC9.4 v28.39,11.59 v28.4,11.6 | IC9.5 v33.7,11.59 v33.7,11.6 | IC9.6 33.66,12.86 v33.7,12.9 | IC9.7 33.64,14.14 v33.7,14.2 | IC9.8 v33.7,15.41 v33.7,15.4 | v15.6,10.5 15.58,10.52 D18.2 12.42,10.52 v12.4,10.5
  Top 1.016: C29.C v38,31.9 C15.C
  Top 1.27: C48.C 29,28.7 v28.7,28.4 | C28.C 37.5,18.8 v37,19.3 36.9,19.4 IC5.1 | 81.11,15.04 JP1.1
  other vias: 57.3,6.8 54.8,6.7 67.6,49 58.5,49 50.6,49 63.7,37.3 61.8,34.1 46.5,48.6 35.2,32.6 40.9,24 35.5,20.9 37.9,12.1 18.8,1.7 1.9,16.5 49.6,23.9 44.1,31.2 58,20.5 78.4,18.8 50,77.4 47.8,34.8 71.2,34.9 72.1,1.3
  pour Bottom (isolate 0.61, rank 6, no thermals): 0,63 2,65 9,65 10,66 10,78 12,80 88,80 90,78 90,67 92,65 98,65 100,63 100,17 98,15 92,15 90,13 90,8 85,8 arc90 82,5 82,0 18,0 18,4 arc90 14,8 10,8 10,13 8,15 2,15 0,17
  pour Top (isolate 0.61, rank 6, no thermals): 0,63 2,65 9,65 10,66 10,78 12,80 88,80 90,78 90,67 92,65 98,65 100,63 100,17 98,15 92,15 90,13 90,8 85,8 arc90 82,5 82,0 18,0 18,4 arc90 14,8 10,8 10,13 8,15 2,15 0,17
GPIO14/LEDOUT  (via drill 0.35)
  Top 0.406: MDL1.5 53,30.6 v54,31.6 | v72.3,20.5 81.7,20.5 82.4,19.8 82.4,17.3 83.6,16.1 86.7,16.1 R12.1
  Bottom 0.406: v54,31.6 54.62,32.22 63.08,32.22 63.26,32.39 70.31,32.39 71.5,31.2 71.5,21.3 v72.3,20.5
IO0/BTN1  (via drill 0.35)
  Top 0.406: 53,13.2 53.8,12.4 54.94,12.4 57,10.34 57.98,10.34 58.62,9.7 60.72,9.7 R22.1 | MDL1.12 53,15.3 v53.1,15.4 | v54.6,17.1 54.6,16.9 55.36,16.14 55.86,16.14 56.6,15.4 61.9,15.4 62.1,15.2 62.1,12.81 62.67,12.24 70.47,12.24 71.5,13.27 71.5,22.1 72.66,23.26 S1.1
  Top 0.508: MDL1.12 53,13.2
  Bottom 0.508: v53.1,15.4 54.6,16.9 v54.6,17.1
IO2_STATUS_LED  (via drill 0.35)
  Top 0.406: R21.1 57.72,9.7 56.72,9.7 54.72,11.7 53.6,11.7 52.9,12.4 51.9,12.4 51,13.3 MDL1.11 v51,15.3
  Bottom 0.508: v51,15.3 51,18 IO2.1
IO12/CHARGERRELAYSIG  (via drill 0.35)
  Top 0.406: MDL1.6 v51,28.5
  Top 0.508: R4.1 35.4,38 v35.4,39.5
  Bottom 0.406: v51,28.5 51,33.1 50.03,34.07 50.03,39.27 48.94,40.36 36.26,40.36 v35.4,39.5
IO13/BATTRELAYSIG  (via drill 0.35)
  Top 0.508: R55.1 43.5,38.08 v43.5,39.5 | v49.8,28.5 49.4,28.5 49,28.9 MDL1.7
  Bottom 0.406: v49.8,28.5 50.37,29.06 50.37,32.84 49.4,33.81 49.4,39.01 48.67,39.73 43.73,39.73 v43.5,39.5
IO15/BEEPER
  Top 0.508: MDL1.10 49,13.3 50,12.3 51.1,12.3 51.64,11.77 52.64,11.77 53.34,11.07 | R31.1 56,9.52 54.46,11.07 53.34,11.07 | R89.2 53,10.73 53.34,11.07
IO16/DEEPSLEEP
  Top 0.508: MDL1.4 55,27.9 52,24.9 52,21 IO16.1
LOAD+
  Top 1.27: D8.1 79.44,4.74 -LED+.1
  Bottom 2.54: -LED+.1 79.31,4.9 83.1,8.7 87.7,8.7 88.3,9.3 88.3,14.6 90.4,16.7 97.7,16.7 98.3,17.3 98.3,54.8 96.1,57 CHARGER2.P1.1
  pour Top (isolate 0.61, rank 3, no thermals): 51,70 73,70 75,68 75,61.3 77,59.3 81.7,59.3 82.4,58.6 82.4,52.7 83.1,52 98,52 98,64 91,64 89,66 89,72 86,72 arc-90 82,76 82,79 51,79
N$1
  pour Top (isolate 0.61, no thermals): 28.1,14.5 25.8,14.5 23.9,16.4 12.7,16.4 12.7,13.8 28.1,13.8
N$2
  Top 0.406: Q4.1 83.15,11.35 83.6,11.8 R23.1 R12.2
N$4
  Top 0.254: IC1.1 56.09,40.8 56.6,40.3 R9.2
N$7
  Top 0.254: IC1.2 57.37,40.73 58,40.1 58,37.4 R8.2
N$8
  Top 0.508: R4.2 R7.1 32.58,42.58 33.05,43.05 Q1.1
N$9
  pour Top (isolate 0.61, no thermals): 31,50 69,50 69,56 66,59 56,59 55,60 55,65 54,66 48,66 47,65 47,60 46,59 34,59 31,56
N$10  (via drill 3.2 pad 5)
  other vias: 14.25,75.75
N$11
  Top 0.508: R89.1 51.92,5.58 51.3,6.2 51.3,6.9 50.95,7.25 Q2.1
N$13
  Top 0.254: IC3.1 65.09,40.8 65.6,40.3 R13.2
N$14
  Top 0.254: IC3.2 66.36,40.63 67,40 67,37.4 R11.2
N$15
  Top 0.254: IC4.1 48.09,40.8 48.6,40.3 R18.2
N$16
  Top 0.254: IC4.2 49.37,40.73 50,40.1 50,38.1 51.4,36.7 R17.2
N$18
  Top 0.406: R28.2 57,30.58 MDL1.3
N$19  (via drill 3.2 pad 5)
  other vias: 85.75,75.75
N$20  (via drill 3.2 pad 5)
  other vias: 85.75,4.25
N$21  (via drill 3.2 pad 5)
  other vias: 14.25,4.25
N$26
  pour Top (isolate 0.61, rank 2, no thermals): 21,20.5 21,17.2 21.2,17 24,17 25.9,15.1 28,15.1 28,18.2 25.6,20.6 21.1,20.6
N$37
  Top 0.508: R55.2 R56.1 40.58,42.58 41.05,43.05 Q3.1
N$41
  Top 1.27: -LED+.2 75.5,6.8 74.56,7.74 D8.2 75.56,11.2 76.5,11.2 77.6,12.3 Q4.3
RESET  (via drill 0.35)
  Top 0.508: MDL1.1 61,31 62,32 62.5,32 | R29.2 64.58,32 62.5,32 | v62.8,32.9 62.8,32.3 62.5,32
  Bottom 0.508: S2.1 71.51,33 62.9,33 v62.8,32.9
RX  (via drill 0.35)
  Top 0.406: MDL1.15 59,12.01 59.41,11.61 61.51,11.61 62.15,10.97 71,10.97 73.13,13.1 v73.3,13.1
  Bottom 0.406: JP1.4 73.49,13.19 73.4,13.1 v73.3,13.1
SCL  (via drill 0.35)
  Top 0.406: MDL1.14 57,12.2 57.6,11.61 58.51,11.61 59.15,10.97 61.25,10.97 61.88,10.34 63.96,10.34 64.6,9.7 66.7,9.7 R2.1 | 57,14.1 55.6,15.5 55.1,15.5 53.76,16.84 47.76,16.84 47.23,17.36 47.23,26.14 48.16,27.06 52.27,27.06 | IC1.4 v59.91,40.51 v59.9,40.5
  Top 0.508: v51.98,40.7 51.98,42.31 IC4.4 | v68.9,40.6 IC3.4 | v52.5,27.3 52.27,27.06 | 57,14.1 MDL1.14
  Bottom 0.406: v68.9,40.6 68.6,40.6 68,40 67,40 66.5,40.5 v59.9,40.5 59.4,40.5 59,40.1 58.2,40.1 57.6,40.7 v51.98,40.7 51.3,40.02 51.3,34.6 52.27,33.63 52.27,29.23 52.53,28.96 52.53,27.84 52.45,27.75 52.45,27.35
  Bottom 0.508: 52.45,27.35 v52.5,27.3
SDA  (via drill 0.35)
  Top 0.406: 55,13.27 57.3,10.97 58.25,10.97 58.88,10.34 60.98,10.34 61.62,9.7 63.7,9.7 R5.1 | v51.7,27.9 51.5,27.7 47.9,27.7 46.6,26.4 46.6,17.1 47.5,16.2 53.5,16.2 55,14.7
  Top 0.508: v50.6,40.7 50.6,42.35 IC4.3 | v58.6,40.81 58.63,40.84 IC1.3 | IC3.3 67.64,40.74 v67.6,40.71 | 55,13.27 MDL1.13 55,14.7
  Bottom 0.406: 50.66,40.63 50.66,34.33 51.63,33.36 51.63,28.96 51.9,28.7 51.9,28.1 v51.7,27.9 | v50.6,40.7 50.8,40.7 51.51,41.41 58,41.41 v58.6,40.81 59,41.21 60.19,41.21 60.27,41.13 66.76,41.13 67.19,40.71 v67.6,40.71
  Bottom 0.508: 50.66,40.63 v50.6,40.7
TX
  Top 0.406: 61,13.01 62.41,11.61 70.7,11.61 73,13.9 74.7,13.9 76.03,15.23 JP1.3
  Top 0.508: MDL1.16 61,13.01
VCC
  Top 0.254: R18.1 51.4,40.2 51.3,40.3 51.3,44.68 51.32,44.7
  Top 0.406: C5.1 48.6,31.7 48.7,31.6 52.5,31.6 53.9,33 R28.1
  Top 0.508: 68,44.8 68.6,44.8 70,43.4 70,38.1 68.4,36.5 R11.1 68.42,35.98 R29.1 | R2.2 R5.2 62.02,5.6 R22.2 R21.2 59,4.3 58.6,3.9 44.2,3.9 42.7,5.4 42.7,7.4 43.1,7.8 43.1,24.25 40.1,27.25 IC5.4
  Top 0.813: IC4.5 51.91,45.89 52.3,45.5 | 52.3,45.5 53.1,45.5 C3.2 54,46.3 56,44.3 59.4,44.3 60.7,45.6 | IC1.5 59.91,45.99 60.3,45.6 60.7,45.6 | 60.7,45.6 61.5,46.4 C2.2 62.7,46.4 63.66,45.44 63.66,44.73 67.93,44.73 68,44.8 68.91,45.7 68.91,46.41 | 68.91,46.41 IC3.5 | C1.2 68.91,46.41 | 52.3,45.5 52.12,45.5 51.32,44.7 50.82,44.2 47.4,44.2 46.5,43.3 46.5,36
  Top 1.016: C29.A C15.A 45.1,33.9 | 45.1,33.9 46,33 47,33 | 47,33 C5.1 | MDL1.8 47,33 | 46.5,36 46.5,35.3 45.1,33.9
  Top 1.27: C29.A 40.8,29.2 39.2,27.6 IC5.4

### Text on the board
tPlace: (2022) PvdW | LOAD+ | GND | GND | BATT+ | PSU+ | GND | RESET | GND | CHG+ | MODE | GND | RX | TX | 5V | +
bPlace: CURRENT/VOLTAGE MONITOR MODULE V2.0